# Altium schematic sheet 01.Table_Revision_History.SchDoc
size A4; PageSetup: Record=PageOptions|CenterHorizontal=True|CenterVertical=True|PrintScale=1.00|XCorrection=1.00|YCorrection=1.00|PrintKind=0|BorderSize=5000000|LeftOffset=0|BottomOffset=0|Orientation=2|PaperLength=1000|PaperWidth=1000|Scale=100|PaperSource=7|PrintQuality=600|MediaType=1|DitherType=10|PaperKind=A4|PrintScaleMode=1; DesignDate: 2025-04-25; SheetName: Table_and_Revision_History; SheetVersion: Rev.A; SheetDescription: 工程目录及版本说明; CheckedBy: YPC; Organization: Altium Limited; Address1: L3, 12a Rodborough Rd; Address2: Frenchs Forest; Address3: NSW; Address4: Australia 2086; DocumentNumber: 1; Revision: V1.00; SheetNumber: 01; SheetTotal: 18; SheetDescribe: 工程目录及版本说明; Designer: JOW; CheckedData: 2025-04-25
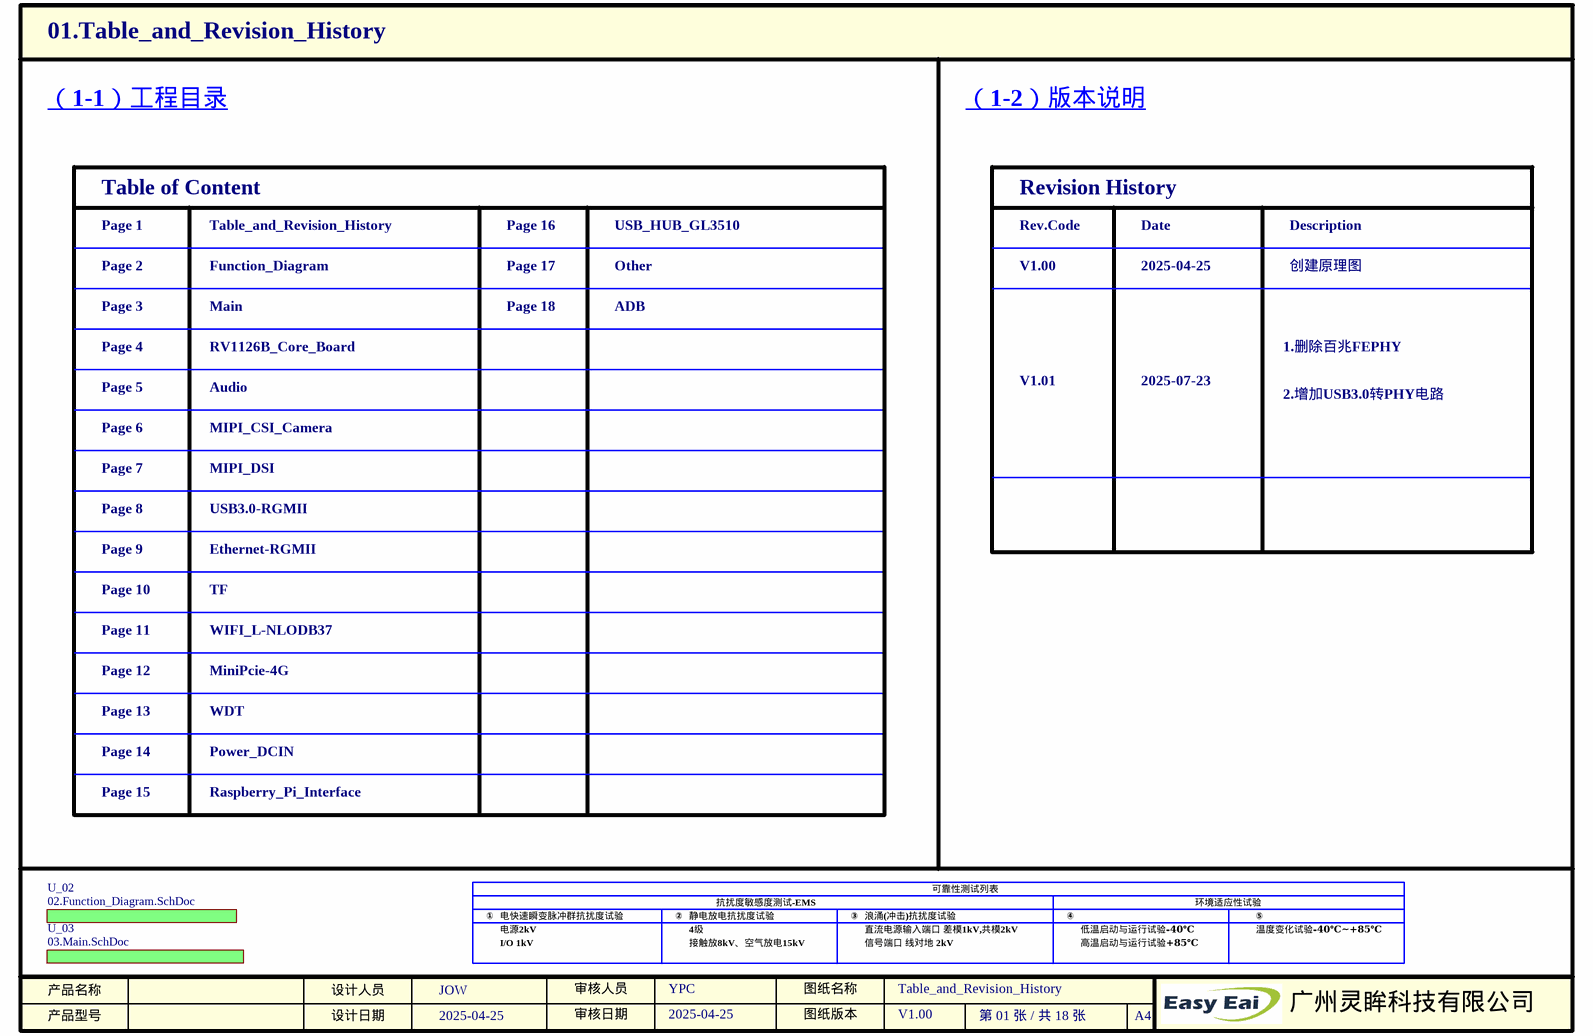
[diagram p0: 01.Table_Revision_History.SchDoc]

## Sub-sheets
U_02 = 02.Function_Diagram.SchDoc: no entries
U_03 = 03.Main.SchDoc: no entries

## Notes on the sheet
- （1-1）工程目录
- （1-2）版本说明
- Table of Content
- Page 1
- Table_and_Revision_History
- Page 16
- USB_HUB_GL3510
- Revision History
- Rev.Code
- Date
- Description
- Page 2
- Page 3
- Function_Diagram
- Main
- Page 17
- Page 18
- Other
- ADB
- V1.00
- 2025-04-25
- 创建原理图
- Page 4
- RV1126B_Core_Board
- V1.01
- 2025-07-23
- 1.删除百兆FEPHY
- Page 5
- Page 6
- Audio
- MIPI_CSI_Camera
- 2.增加USB3.0转PHY电路
- Page 7
- Page 8
- MIPI_DSI
- USB3.0-RGMII
- Page 9
- Ethernet-RGMII
- Page 10
- Page 11
- TF
- WIFI_L-NLODB37
- Page 12
- Page 13
- MiniPcie-4G
- WDT
- Page 14
- Power_DCIN
- Page 15
- Raspberry_Pi_Interface
- ①
- 电快速瞬变脉冲群抗扰度试验
- ②
- 静电放电抗扰度试验
- 抗扰度敏感度测试-EMS
- ③
- 浪涌(冲击)抗扰度试验
- 可靠性测试列表
- ④
- 环境适应性试验
- ⑤
- 电源2kV
- I/O 1kV
- 4级
- 接触放8kV、空气放电15kV
- 直流电源输入端口 差模1kV,共模2kV
- 信号端口 线对地 2kV
- 低温启动与运行试验-40℃
- 高温启动与运行试验+85℃
- 温度变化试验-40℃~+85℃
- 产品名称
- 产品型号
- 设计人员
- 设计日期
- 审核人员
- 审核日期
- 图纸版本
- 图纸名称
- A4
- 广州灵眸科技有限公司